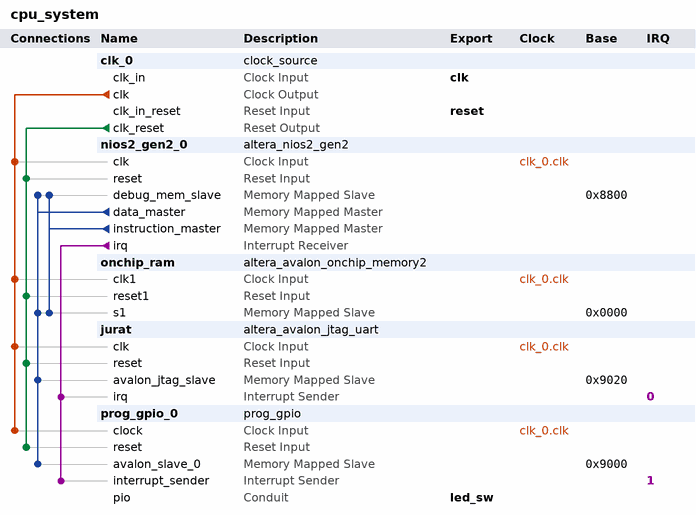
[diagram p0: system contents]
# Platform Designer (Qsys) system cpu_system, Cyclone V 5CSEMA5F31C6
# Parameters at their usual value, and those the tool derives, are not listed.
package require -exact qsys 21.1
create_system cpu_system
set_project_property DEVICE_FAMILY {Cyclone V}
set_project_property DEVICE 5CSEMA5F31C6

add_instance clk_0 clock_source 21.1
set_instance_parameter_value clk_0 clockFrequency 50000000

add_instance nios2_gen2_0 altera_nios2_gen2 21.1
set_instance_parameter_value nios2_gen2_0 dcache_size 2048
set_instance_parameter_value nios2_gen2_0 exceptionSlave onchip_ram.s1
set_instance_parameter_value nios2_gen2_0 icache_size 4096
set_instance_parameter_value nios2_gen2_0 impl Tiny
set_instance_parameter_value nios2_gen2_0 resetSlave onchip_ram.s1

add_instance onchip_ram altera_avalon_onchip_memory2 21.1
set_instance_parameter_value onchip_ram dataWidth 32
set_instance_parameter_value onchip_ram dualPort false
set_instance_parameter_value onchip_ram initMemContent true
set_instance_parameter_value onchip_ram initializationFileName onchip_mem.hex
set_instance_parameter_value onchip_ram memorySize 20480

add_instance jurat altera_avalon_jtag_uart 21.1
set_instance_parameter_value jurat simInteractiveOptions NO_INTERACTIVE_WINDOWS

add_instance prog_gpio_0 prog_gpio 1.0

# connections
add_connection clk_0.clk jurat.clk clock
add_connection clk_0.clk nios2_gen2_0.clk clock
add_connection clk_0.clk onchip_ram.clk1 clock
add_connection clk_0.clk prog_gpio_0.clock clock
add_connection clk_0.clk_reset jurat.reset reset
add_connection clk_0.clk_reset nios2_gen2_0.reset reset
add_connection clk_0.clk_reset onchip_ram.reset1 reset
add_connection clk_0.clk_reset prog_gpio_0.reset reset
add_connection nios2_gen2_0.data_master jurat.avalon_jtag_slave avalon
set_connection_parameter_value nios2_gen2_0.data_master/jurat.avalon_jtag_slave baseAddress 0x9020
add_connection nios2_gen2_0.data_master nios2_gen2_0.debug_mem_slave avalon
set_connection_parameter_value nios2_gen2_0.data_master/nios2_gen2_0.debug_mem_slave baseAddress 0x8800
add_connection nios2_gen2_0.data_master onchip_ram.s1 avalon
set_connection_parameter_value nios2_gen2_0.data_master/onchip_ram.s1 baseAddress 0x0000
add_connection nios2_gen2_0.data_master prog_gpio_0.avalon_slave_0 avalon
set_connection_parameter_value nios2_gen2_0.data_master/prog_gpio_0.avalon_slave_0 baseAddress 0x9000
add_connection nios2_gen2_0.instruction_master nios2_gen2_0.debug_mem_slave avalon
set_connection_parameter_value nios2_gen2_0.instruction_master/nios2_gen2_0.debug_mem_slave baseAddress 0x8800
add_connection nios2_gen2_0.instruction_master onchip_ram.s1 avalon
set_connection_parameter_value nios2_gen2_0.instruction_master/onchip_ram.s1 baseAddress 0x0000
add_connection nios2_gen2_0.irq jurat.irq interrupt
set_connection_parameter_value nios2_gen2_0.irq/jurat.irq irqNumber 0
add_connection nios2_gen2_0.irq prog_gpio_0.interrupt_sender interrupt
set_connection_parameter_value nios2_gen2_0.irq/prog_gpio_0.interrupt_sender irqNumber 1

# exported interfaces
add_interface clk clock sink
set_interface_property clk EXPORT_OF clk_0.clk_in
add_interface led_sw conduit end
set_interface_property led_sw EXPORT_OF prog_gpio_0.pio
add_interface reset reset sink
set_interface_property reset EXPORT_OF clk_0.clk_in_reset

set_interconnect_requirement {$system} qsys_mm.clockCrossingAdapter HANDSHAKE
set_interconnect_requirement {$system} qsys_mm.enableEccProtection FALSE
set_interconnect_requirement {$system} qsys_mm.insertDefaultSlave FALSE
set_interconnect_requirement {$system} qsys_mm.maxAdditionalLatency 1

save_system cpu_system.qsys
